# EAGLE design wrt54_relay_board (EAGLE 6.1)
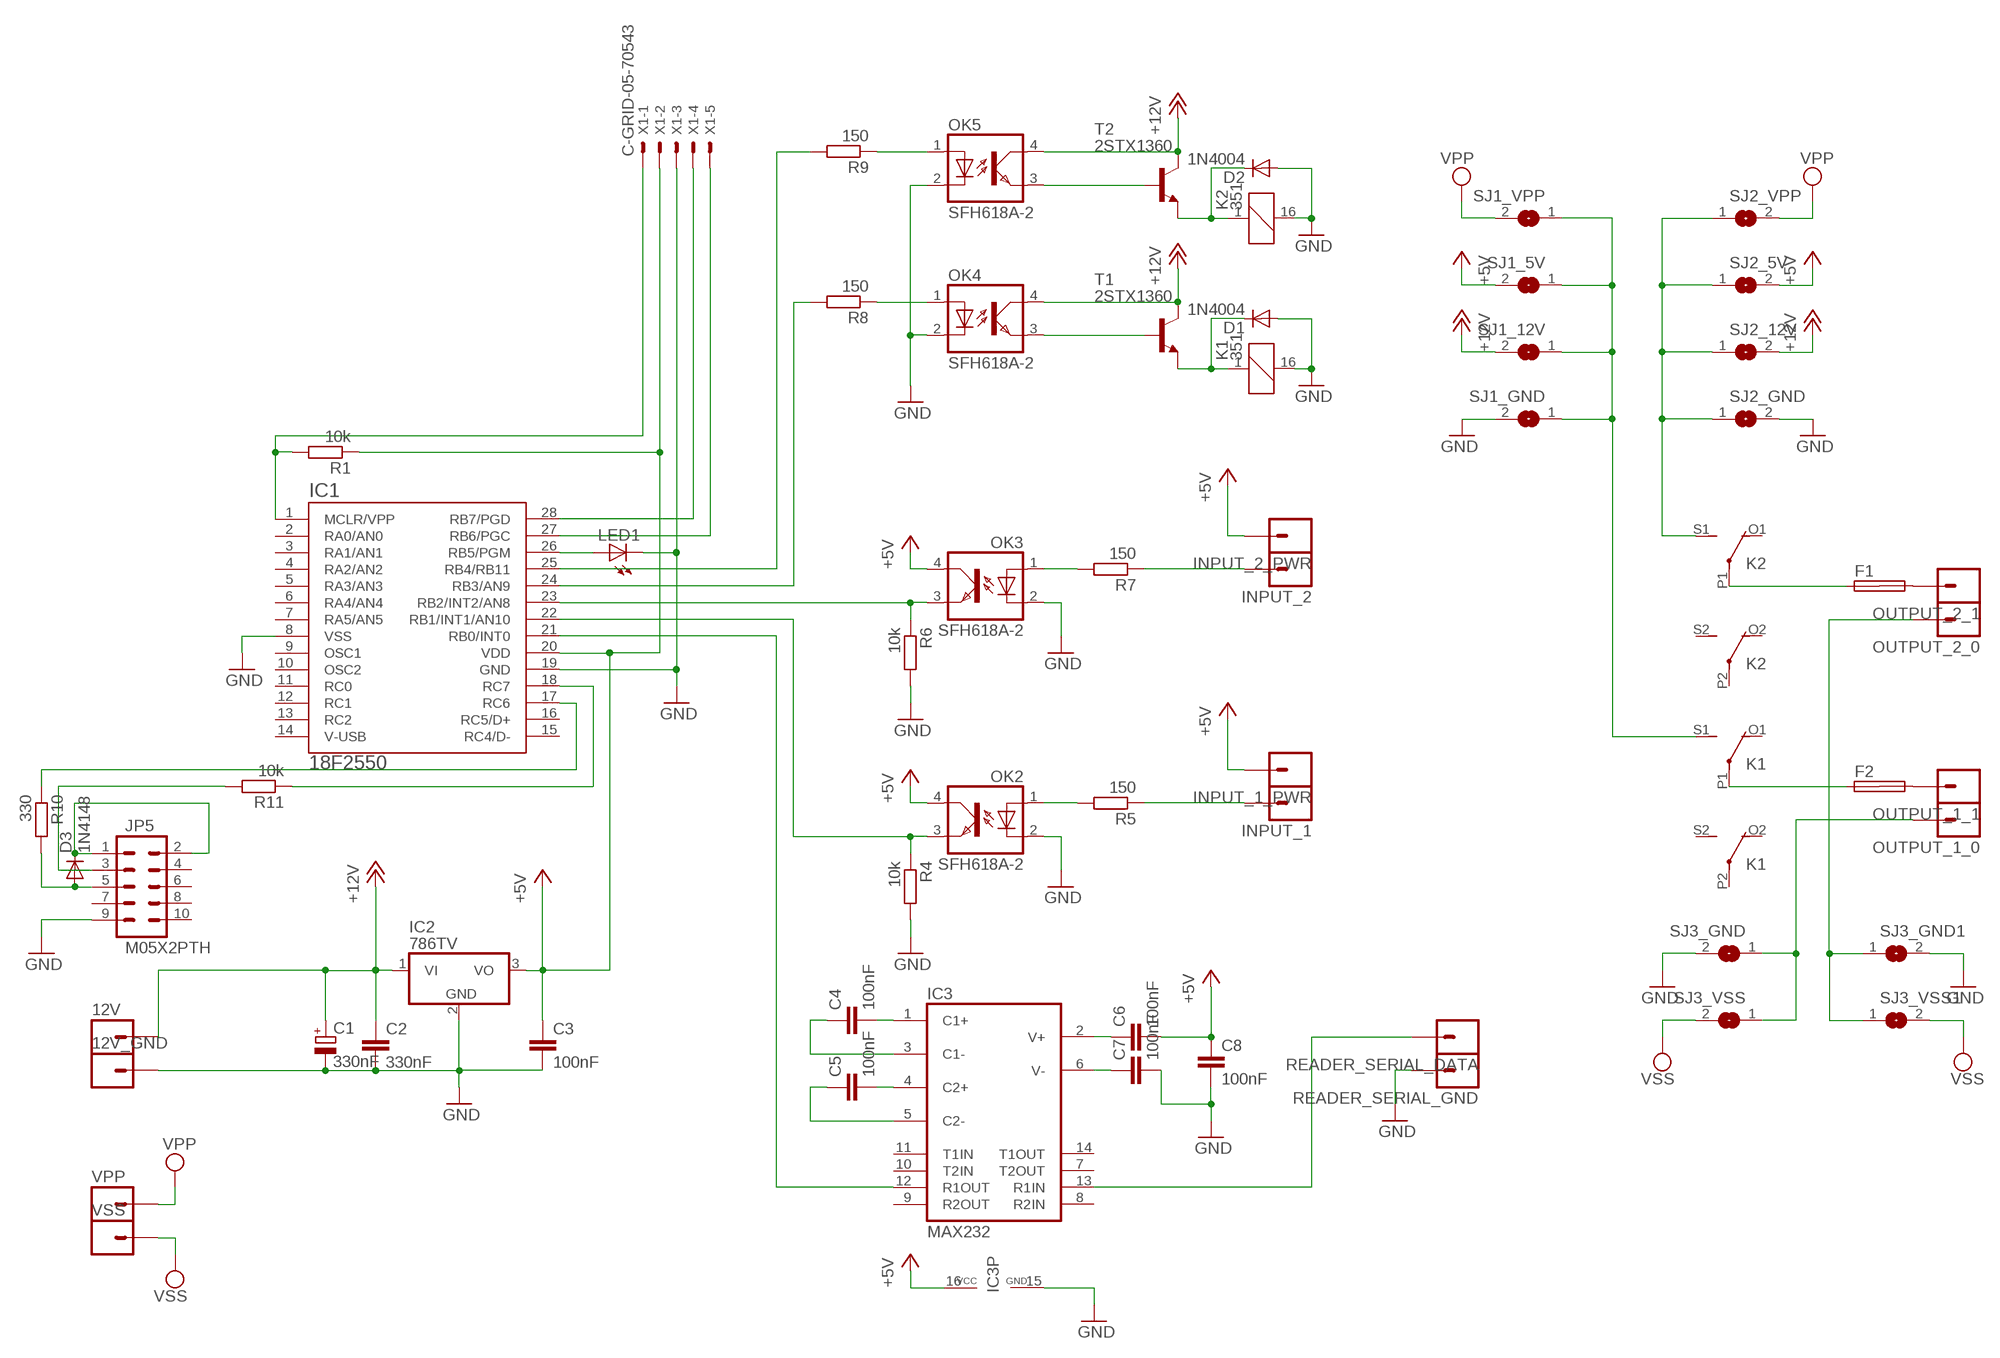
[diagram p0: schematic, sheet 1]

## Parts
12V  M01PTH_LONGPAD  [1X01_LONGPAD]
12V_GND  M01PTH_LONGPAD  [1X01_LONGPAD]
C1  330nF  CPOL-EUE5-6  [E5-6]
C2  330nF  C5/2.5  [C5B2.5]
C3  100nF  C5/2.5  [C5B2.5]
C4  100nF  C5/2.5  [C5B2.5]
C5  100nF  C5/2.5  [C5B2.5]
C6  100nF  C5/2.5  [C5B2.5]
C7  100nF  C5/2.5  [C5B2.5]
C8  100nF  C5/2.5  [C5B2.5]
D1  1N4004  1N4148DO35-7  [DO35-7]
D2  1N4004  1N4148DO35-7  [DO35-7]
D3  1N4148  1N4148DO35-7  [DO35-7]
F1  SHK20L  [SHK20L]
F2  SHK20L  [SHK20L]
IC1  18F2550  PIC18F2550DIL-28  [DIL28]
IC2  786TV  [TO220V]
IC3  MAX232  [DIL16]
INPUT_1  M01PTH_LONGPAD  [1X01_LONGPAD]
INPUT_1_PWR  M01PTH_LONGPAD  [1X01_LONGPAD]
INPUT_2  M01PTH_LONGPAD  [1X01_LONGPAD]
INPUT_2_PWR  M01PTH_LONGPAD  [1X01_LONGPAD]
JP5  M05X2PTH  [AVR_ICSP]
K1  351  [351]
K2  351  [351]
LED1  LED5MM  [LED5MM]
OK2  SFH618A-2  [DIP4]
OK3  SFH618A-2  [DIP4]
OK4  SFH618A-2  [DIP4]
OK5  SFH618A-2  [DIP4]
OUTPUT_1_0  M01PTH_LONGPAD  [1X01_LONGPAD]
OUTPUT_1_1  M01PTH_LONGPAD  [1X01_LONGPAD]
OUTPUT_2_0  M01PTH_LONGPAD  [1X01_LONGPAD]
OUTPUT_2_1  M01PTH_LONGPAD  [1X01_LONGPAD]
R1  10k  R-EU_0204/7  [0204/7]
R4  10k  R-EU_0207/10  [0207/10]
R5  150  R-EU_0204/2V  [0204V]
R6  10k  R-EU_0207/10  [0207/10]
R7  150  R-EU_0204/2V  [0204V]
R8  150  R-EU_0204/7  [0204/7]
R9  150  R-EU_0204/7  [0204/7]
R10  330  R-EU_0204/2V  [0204V]
R11  10k  R-EU_0204/2V  [0204V]
READER_SERIAL_DATA  M01PTH_LONGPAD  [1X01_LONGPAD]
READER_SERIAL_GND  M01PTH_LONGPAD  [1X01_LONGPAD]
SJ1_5V  SJW  [SJW]
SJ1_12V  SJW  [SJW]
SJ1_GND  SJW  [SJW]
SJ1_VPP  SJW  [SJW]
SJ2_5V  SJW  [SJW]
SJ2_12V  SJW  [SJW]
SJ2_GND  SJW  [SJW]
SJ2_VPP  SJW  [SJW]
SJ3_GND  SJW  [SJW]
SJ3_GND1  SJW  [SJW]
SJ3_VSS  SJW  [SJW]
SJ3_VSS1  SJW  [SJW]
T1  2STX1360  2SC1740  [TO92-ECB]
T2  2STX1360  2SC1740  [TO92-ECB]
VPP  M01PTH_LONGPAD  [1X01_LONGPAD]
VSS  M01PTH_LONGPAD  [1X01_LONGPAD]
X1  C-GRID-05-70543  [70543-05]

## Nets
+5V: C3.1 C6.2 C8.1 IC1.20(VDD) IC2.3(VO) IC3.16(VCC) INPUT_1_PWR.1 INPUT_2_PWR.1 OK2.4(COL) OK3.4(COL) R1.1 SJ1_5V.2 SJ2_5V.2 X1.2
+12V: 12V.1 C1.+ C2.1 IC2.1(VI) OK4.4(COL) OK5.4(COL) SJ1_12V.2 SJ2_12V.2 T1.C T2.C
GND [power]: 12V_GND.1 C1.- C2.2 C3.2 C7.2 C8.2 D1.A D2.A IC1.8(VSS) IC1.19(GND) IC2.2(GND) IC3.15(GND) JP5.9 K1.16 K2.16 LED1.K(C) OK2.2(C) OK3.2(C) OK4.2(C) OK5.2(C) R4.2 R6.2 READER_SERIAL_GND.1 SJ1_GND.2 SJ2_GND.2 SJ3_GND1.2 SJ3_GND.2 X1.3
N$1: IC1.23(RB2/INT2/AN8) OK3.3(EMIT) R6.1
N$2: OK2.1(A) R5.2
N$3: INPUT_1.1 R5.1
N$4: IC1.22(RB1/INT1/AN10) OK2.3(EMIT) R4.1
N$5: INPUT_2.1 R7.1
N$6: IC1.25(RB4/RB11) R9.2
N$7: OK5.3(EMIT) T2.B
N$8: OK4.3(EMIT) T1.B
N$9: IC1.28(RB7/PGD) X1.4
N$10: IC1.1(MCLR/VPP) R1.2 X1.1
N$11: D2.C K2.1 T2.E
N$12: D1.C K1.1 T1.E
N$13: C4.2 IC3.1(C1+)
N$14: IC1.26(RB5/PGM) LED1.A
N$15: IC1.21(RB0/INT0) IC3.12(R1OUT)
N$16: IC3.13(R1IN) READER_SERIAL_DATA.1
N$17: OK3.1(A) R7.2
N$18: K2.S1(2:S) SJ2_5V.1 SJ2_12V.1 SJ2_GND.1 SJ2_VPP.1
N$19: OK5.1(A) R9.1
N$20: K1.S1(2:S) SJ1_5V.1 SJ1_12V.1 SJ1_GND.1 SJ1_VPP.1
N$21: F1.2A OUTPUT_2_1.1
N$22: F2.2A OUTPUT_1_1.1
N$23: OUTPUT_1_0.1 SJ3_GND.1 SJ3_VSS.1
N$24: IC1.17(RC6) R10.1
N$25: IC1.18(RC7) R11.1
N$26: OUTPUT_2_0.1 SJ3_GND1.1 SJ3_VSS1.1
N$29: F1.1A K2.P1(2:P)
N$30: F2.1A K1.P1(2:P)
N$31: C5.2 IC3.4(C2+)
N$32: C4.1 IC3.3(C1-)
N$33: D3.C JP5.1 JP5.2
N$34: D3.A JP5.5 R10.2
N$35: C5.1 IC3.5(C2-)
N$36: C6.1 IC3.2(V+)
N$37: C7.1 IC3.6(V-)
N$39: JP5.3 R11.2
N$44: IC1.24(RB3/AN9) R8.2
N$51: OK4.1(A) R8.1
N$53: IC1.27(RB6/PGC) X1.5
VPP: SJ1_VPP.2 SJ2_VPP.2 VPP.1
VSS: SJ3_VSS1.2 SJ3_VSS.2 VSS.1
Unconnected: F1.1B F1.2B F2.1B F2.2B IC1.2(RA0/AN0) IC1.3(RA1/AN1) IC1.4(RA2/AN2) IC1.5(RA3/AN3) IC1.6(RA4/AN4) IC1.7(RA5/AN5) IC1.9(OSC1) IC1.10(OSC2) IC1.11(RC0) IC1.12(RC1) IC1.13(RC2) IC1.14(V-USB) IC1.15(RC4/D-) IC1.16(RC5/D+) IC3.7(T2OUT) IC3.8(R2IN) IC3.9(R2OUT) IC3.10(T2IN) IC3.11(T1IN) IC3.14(T1OUT) JP5.4 JP5.6 JP5.7 JP5.8 JP5.10 K1.O1(2:O) K1.O2(3:O) K1.P2(3:P) K1.S2(3:S) K2.O1(2:O) K2.O2(3:O) K2.P2(3:P) K2.S2(3:S)

## Library data of the parts
12V 12V_GND INPUT_1 INPUT_1_PWR INPUT_2 INPUT_2_PWR OUTPUT_1_0 OUTPUT_1_1 OUTPUT_2_0 OUTPUT_2_1 READER_SERIAL_DATA READER_SERIAL_GND VPP VSS = SparkFun:M01: Header 1 Standard 1-pin 0.1" header. Use with straight break away headers (SKU : PRT-00116), right angle break away headers (PRT-00553), swiss pins (PRT-00743), machine pins (PRT-00117), and female headers (PRT-00115).
C1 = resistor:CPOL-EU: POLARIZED CAPACITOR, European symbol
C2-C8 = capacitor-wima:C: CAPACITOR naming: grid - package width
D1-D3 = diode:1N4148: DIODE high speed (Philips)
F1 F2 = fuse:SHK20L: FUSE HOLDER 5 x 20 mm, SH contact, SHH1 Schukat, E1073 Buerklin; OC_FARNELL: unknown; OC_NEWARK: unknown
IC1 = pic18f2550:PIC18F2550: PIC18F2550 Richard Myrick T. Arellaga April 2010
IC2 = linear:78*: Positive VOLTAGE REGULATOR Source: http://cache.national.com/ds/LM/LM78L05.pdf http://www.fairchildsemi.com/ds/LM/LM7805.pdf
IC3 = maxim:MAX232: RS232 TRANSEIVER; MF: MAXIM; MPN: MAX232ACPE+; OC_FARNELL: 9723773; OC_NEWARK: 68K4544
JP5 = SparkFun:M05X2: Header 5x2 Standard 10-pin dual row 0.1" header. Commonly used with AVR-ISP. Use with Spark Fun Electronics SKU: PRT-00778
K1 K2 = relay:351: RELAY 2 x switch, Omron; OC_FARNELL: unknown; OC_NEWARK: unknown
LED1 = led:LED: LED OSRAM: - CHIPLED LG R971, LG N971, LY N971, LG Q971, LY Q971, LO R971, LY R971 LH N974, LH R974 LS Q976, LO Q976, LY Q976 LO Q996 - Hyper CHIPLED LW Q18S LB Q993, LB Q99A, LB R99A - SideLED LS A670, LO A670, LY A670, LG A670, LP A670 LB A673, LV A673, LT A673, LW A673 LH A674 LY A675 LS A676, LA A676, LO A676, LY A676, LW A676 LS A679, LY A679, LG A679 - Hyper Micro SIDELED® LS Y876, LA Y876, LO Y876, LY Y876 LT Y87S - SmartLED LW L88C, LW L88S LB L89C, LB L89S, LG L890 LS L89K, LO L89K, LY L89K LS L896, LA L896, LO L896, LY L896 - TOPLED LS T670, LO T670, LY T670, LG T670, LP T670 LSG T670, LSP T670, LSY T670, LOP T670, LYG T670 LG T671, LOG T671, LSG T671 LB T673, LV T673, LT T673, LW T673 LH T674 LS T676, LA T676, LO T676, LY T676, LB T676, LH T676, LSB T676, LW T676 LB T67C, LV T67C, LT T67C, LS T67K, LO T67K, LY T67K, LW E67C LS E67B, LA E67B, LO E67B, LY E67B, LB E67C, LV E67C, LT E67C LW T67C LS T679, LY T679, LG T679 LS T770, LO T770, LY T770, LG T770, LP T770 LB T773, LV T773, LT T773, LW T773 LH T774 LS E675, LA E675, LY E675, LS T675 LS T776, LA T776, LO T776, LY T776, LB T776 LHGB T686 LT T68C, LB T68C - Hyper Mini TOPLED® LB M676 - Mini TOPLED Santana® LG M470 LS M47K, LO M47K, LY M47K Source: http://www.osram.convergy.de LUXEON: - LUMILED® LXK2-PW12-R00, LXK2-PW12-S00, LXK2-PW14-U00, LXK2-PW14-V00 LXK2-PM12-R00, LXK2-PM12-S00, LXK2-PM14-U00 LXK2-PE12-Q00, LXK2-PE12-R00, LXK2-PE12-S00, LXK2-PE14-T00, LXK2-PE14-U00 LXK2-PB12-K00, LXK2-PB12-L00, LXK2-PB12-M00, LXK2-PB14-N00, LXK2-PB14-P00, LXK2-PB14-Q00 LXK2-PR12-L00, LXK2-PR12-M00, LXK2-PR14-Q00, LXK2-PR14-R00 LXK2-PD12-Q00, LXK2-PD12-R00, LXK2-PD12-S00 LXK2-PH12-R00, LXK2-PH12-S00 LXK2-PL12-P00, LXK2-PL12-Q00, LXK2-PL12-R00 Source: www.luxeon.com KINGBRIGHT: KA-3528ASYC Source: www.kingbright.com
OK2-OK5 = optocoupler:SFH618?*: Optocoupler, Phototransistor Output, Low Input Current Source: http://www.vishay.com/docs/83673/sfh618.pdf
R1 R4-R11 = resistor:R-EU_: RESISTOR, European symbol
SJ1_5V SJ1_12V SJ1_GND SJ1_VPP SJ2_5V SJ2_12V SJ2_GND SJ2_VPP SJ3_GND SJ3_GND1 SJ3_VSS SJ3_VSS1 = jumper:SJ: SMD solder JUMPER
T1 T2 = transistor:2SC1740: NPN Silicon Epitaxial Planar Transistor Source: SEMTECH ELECTRONICS LTD. 2SC1740.pdf
X1 = con-molex:C-GRID-05: CONNECTOR wire to board 2.54 mm (0.100") pitch header

## Net classes
1 power: width 1.676 mm, clearance 0.508 mm

## Board
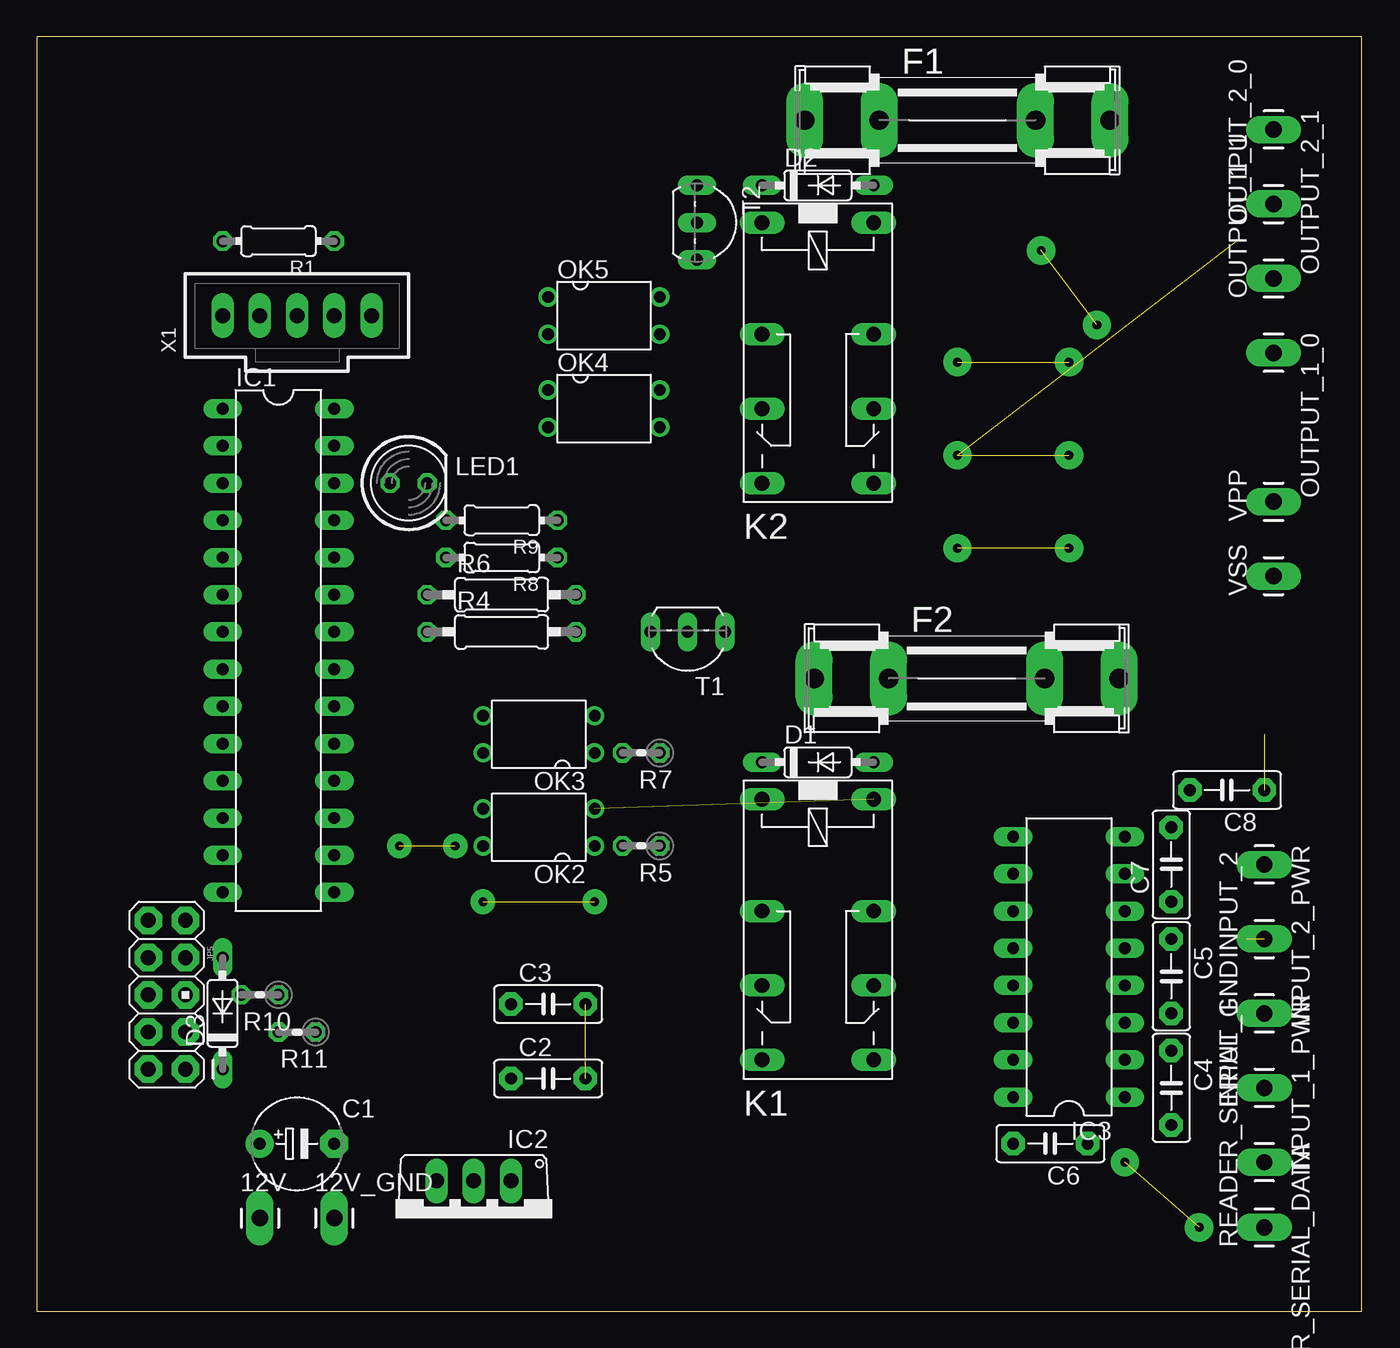
[diagram p1: board, top side]
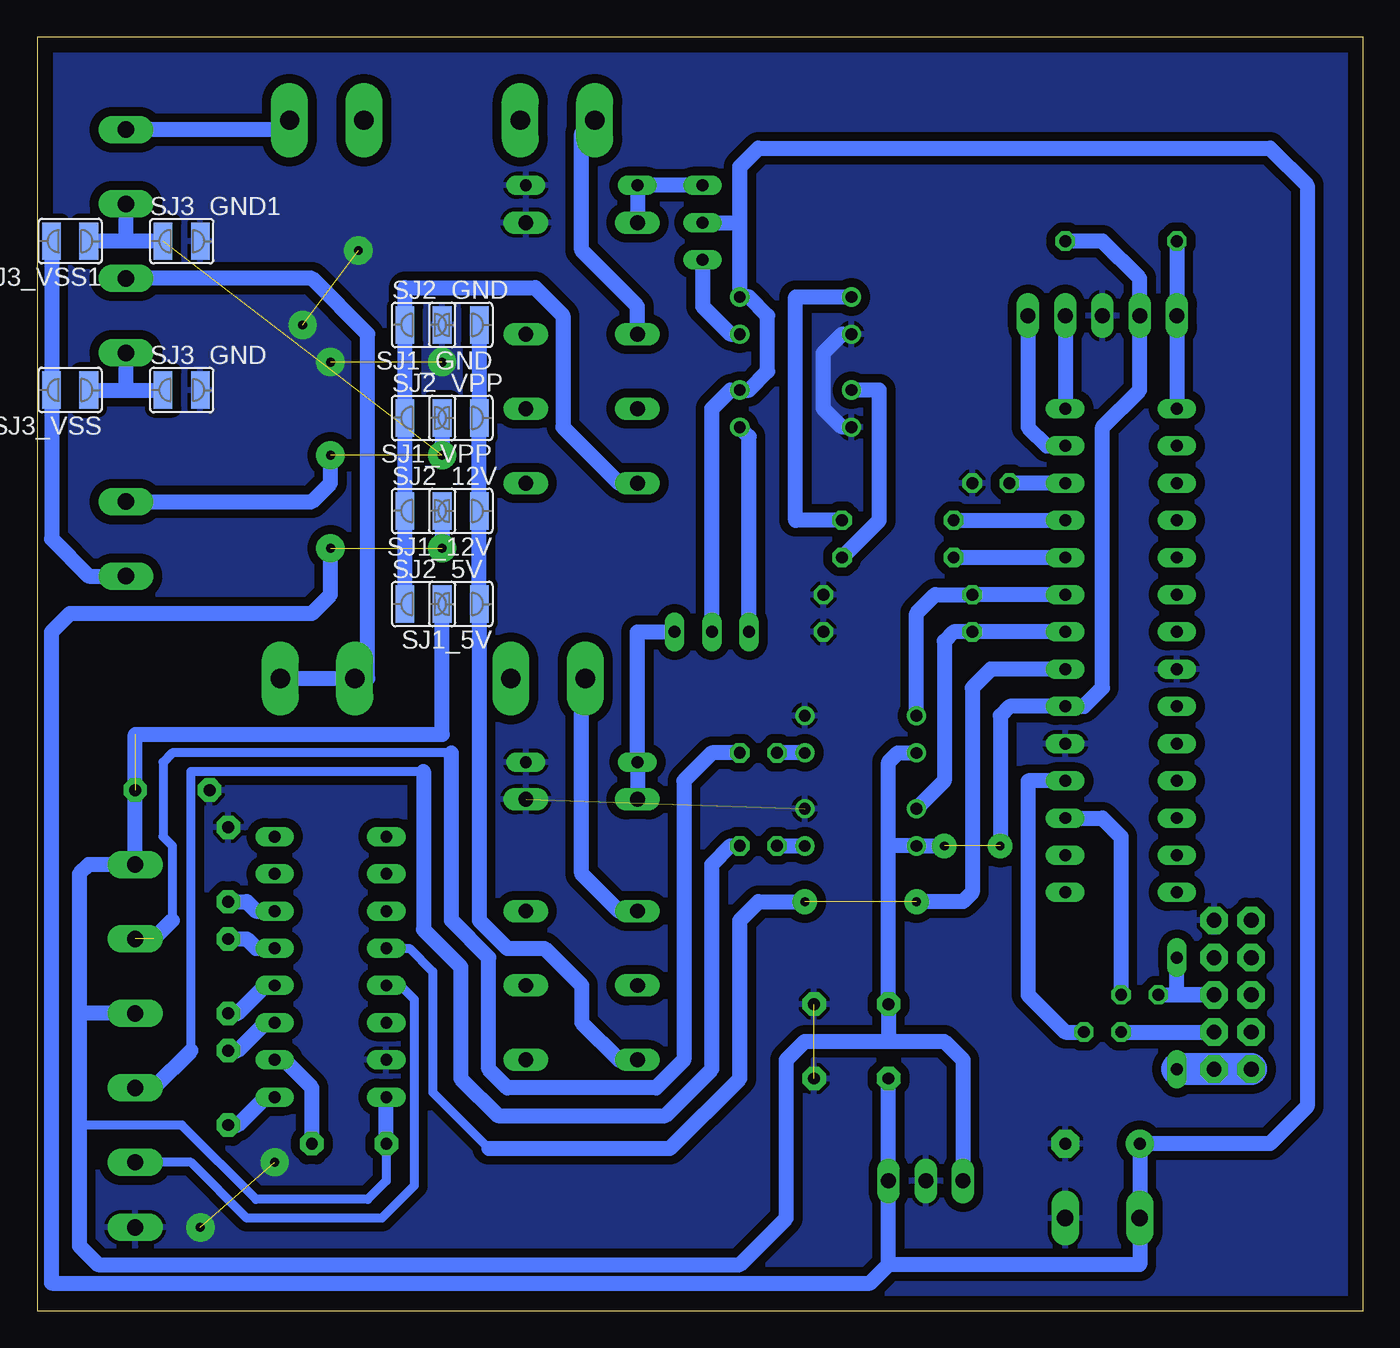
[diagram p2: board, bottom side, seen from below]

Size 90.48 x 86.99 mm. Coordinates in mm from the lower left corner, seen from the top.
Outline: 0,0 90.48,0 90.48,86.99 0,86.99 0,0
Copper layers (1*16): Top 0.035mm / dielectric 1.5mm / Bottom 0.035mm
Design rules: minimum track width 10mil, minimum drill 24mil, track to track 8mil, track to pad 8mil, pad to pad 8mil, via to via 8mil, smd to smd 8mil, copper to edge 40mil, drill to drill 8mil, minimum pad ring 10mil, minimum via ring 8mil, stop-mask expansion 4mil, vias tented up to drill 0mil, thermal gap 10mil

### Footprints (pad centres in the part's own frame; a part is rotated, then mirrored left to right if it is on the bottom)
1X01_LONGPAD = drill 1.118 pad 1.88 long: 1 0,0
E5-6 = drill 0.813 pad 1.905: + -2.54,0 | drill 0.813 pad 1.905 octagon: - 2.54,0
C5B2.5 = drill 0.813 pad 1.6 octagon: 1 -2.54,0; 2 2.54,0
DO35-7 = drill 0.813 long: A 3.81,0; C -3.81,0
SHK20L = drill 1.321 pad 2.54 long: 1A -10.414,0; 1B -5.334,0; 2A 10.414,0; 2B 5.334,0
DIL28 = drill 0.813 long: 1 -16.51,-3.81; 2 -13.97,-3.81; 3 -11.43,-3.81; 4 -8.89,-3.81; 5 -6.35,-3.81; 6 -3.81,-3.81; 7 -1.27,-3.81; 8 1.27,-3.81; 9 3.81,-3.81; 10 6.35,-3.81; 11 8.89,-3.81; 12 11.43,-3.81; 13 13.97,-3.81; 14 16.51,-3.81; 15 16.51,3.81; 16 13.97,3.81; 17 11.43,3.81; 18 8.89,3.81; 19 6.35,3.81; 20 3.81,3.81; 21 1.27,3.81; 22 -1.27,3.81; 23 -3.81,3.81; 24 -6.35,3.81; 25 -8.89,3.81; 26 -11.43,3.81; 27 -13.97,3.81; 28 -16.51,3.81
TO220V = drill 1.016 long: 1 -2.54,-2.54; 2 0,-2.54; 3 2.54,-2.54
DIL16 = drill 0.813 long: 1 -8.89,-3.81; 2 -6.35,-3.81; 3 -3.81,-3.81; 4 -1.27,-3.81; 5 1.27,-3.81; 6 3.81,-3.81; 7 6.35,-3.81; 8 8.89,-3.81; 9 8.89,3.81; 10 6.35,3.81; 11 3.81,3.81; 12 1.27,3.81; 13 -1.27,3.81; 14 -3.81,3.81; 15 -6.35,3.81; 16 -8.89,3.81
AVR_ICSP = drill 1.016 pad 1.88 octagon: 1 -1.27,5.08; 2 1.27,5.08; 3 -1.27,2.54; 4 1.27,2.54; 5 -1.27,0; 6 1.27,0; 7 -1.27,-2.54; 8 1.27,-2.54; 9 -1.27,-5.08; 10 1.27,-5.08
351 = drill 1.016 long: 1 -3.81,-3.81; 16 -3.81,3.81; O1 8.89,-3.81; O2 8.89,3.81; P1 3.81,-3.81; P2 3.81,3.81; S1 13.97,-3.81; S2 13.97,3.81
LED5MM = drill 0.813 octagon: A -1.27,0; K 1.27,0
DIP4 = drill 0.8: 1 -1.27,-3.81; 2 1.27,-3.81; 3 1.27,3.81; 4 -1.27,3.81
0204/7 = drill 0.813 octagon: 1 -3.81,0; 2 3.81,0
0207/10 = drill 0.813 octagon: 1 -5.08,0; 2 5.08,0
0204V = drill 0.813 octagon: 1 -1.27,0; 2 1.27,0
SJW = smd 1.27 x 2.54: 1 -1.27,0; 2 1.27,0
TO92-ECB = drill 0.813 long: B 2.54,0; C 0,0; E -2.54,0
70543-05 = drill 1.016 long: 1 -5.08,0; 2 -2.54,0; 3 0,0; 4 2.54,0; 5 5.08,0

### Placement (x,y rotation side)
12V  15.24,6.35 0 top
12V_GND  20.32,6.35 0 top
C1  17.78,11.43 0 top
C2  34.92,15.88 0 top
C3  34.92,20.96 0 top
C4  77.47,15.24 270 top
C5  77.47,22.86 270 top
C6  69.22,11.43 180 top
C7  77.47,30.48 90 top
C8  81.28,35.56 180 top
D1  53.34,37.47 0 top
D2  53.34,76.84 0 top
D3  12.7,20.32 90 top
F1  62.87,81.28 0 top
F2  63.5,43.18 0 top
IC1  16.51,45.09 270 top
IC2  29.84,6.35 180 top
IC3  70.48,23.5 90 top
INPUT_1  83.82,15.24 90 top
INPUT_1_PWR  83.82,20.32 270 top
INPUT_2  83.82,25.4 90 top
INPUT_2_PWR  83.82,30.48 270 top
JP5  8.89,21.59 180 top
K1  53.34,31.12 270 top
K2  53.34,70.49 270 top
LED1  25.4,56.52 0 top
OK2  34.29,33.02 90 top
OK3  34.29,39.37 90 top
OK4  38.73,61.59 270 top
OK5  38.73,67.94 270 top
OUTPUT_1_0  84.46,65.41 270 top
OUTPUT_1_1  84.46,70.49 90 top
OUTPUT_2_0  84.46,75.56 90 top
OUTPUT_2_1  84.46,80.65 270 top
R1  16.51,73.03 180 top
R4  31.75,46.35 0 top
R5  41.27,31.75 180 top
R6  31.75,48.9 0 top
R7  41.27,38.1 180 top
R8  31.75,51.44 180 top
R9  31.75,53.98 180 top
R10  15.24,21.59 180 top
R11  17.78,19.05 180 top
READER_SERIAL_DATA  83.82,10.16 270 top
READER_SERIAL_GND  83.82,5.71 90 top
SJ1_5V  61.59,48.26 180 bottom
SJ1_12V  61.59,54.61 180 bottom
SJ1_GND  61.59,67.31 180 bottom
SJ1_VPP  61.59,60.96 180 bottom
SJ2_5V  64.14,48.26 0 bottom
SJ2_12V  64.14,54.61 0 bottom
SJ2_GND  64.14,67.31 0 bottom
SJ2_VPP  64.14,60.96 0 bottom
SJ3_GND  80.65,62.87 0 bottom
SJ3_GND1  80.65,73.03 0 bottom
SJ3_VSS  88.27,62.87 180 bottom
SJ3_VSS1  88.27,73.03 180 bottom
T1  44.45,46.35 180 top
T2  45.09,74.29 270 top
VPP  84.46,55.24 90 top
VSS  84.46,50.16 90 top
X1  17.78,67.94 0 top

### Tracks (layer width: path | path; a pad name or v marks a point on that pad's centre or on a via)
+5V  (via drill 0.6 pad 1.68)  (2 unrouted)
  Bottom 0.61: IC3.16 66.68,8.89 67.95,7.62 75.57,7.62 80.65,12.7 87.31,12.7 87.63,13.02
  Bottom 1.016: R1.1 17.78,73.03 15.24,70.49 X1.2 15.24,62.87 17.78,60.33 17.78,42.55 19.05,41.27 IC1.20 24.13,41.27 24.77,40.64 v24.77,31.75 | SJ1_5V.2 62.87,39.37 83.82,39.37 INPUT_2_PWR.1 87,30.48 87.63,29.84 87.63,20.32 | 32.38,31.75 C3.1 32.38,18.41 | 32.38,31.75 32.38,37.47 31.75,38.1 OK3.4 | 32.38,31.75 OK2.4 28.57,31.75 | 87.63,20.32 87.63,13.02 87.63,4.45 86.36,3.18 42.55,3.18 39.37,6.35 39.37,17.14 38.1,18.41 32.38,18.41 | INPUT_1_PWR.1 87.63,20.32 | 32.38,18.41 28.57,18.41 27.3,17.14 IC2.3 | C6.2 IC3.16
+12V  (via drill 0.6 pad 1.93)  (1 unrouted)
  Bottom 1.016: SJ1_12V.2 62.87,52.07 | 42.55,74.29 OK5.4 41.91,69.22 40.64,67.94 40.64,64.13 41.91,62.87 OK4.4 43.18,62.87 44.45,61.59 T1.C | 42.55,74.29 42.55,78.1 41.27,79.38 6.35,79.38 3.81,76.84 3.81,13.97 6.35,11.43 C1.+ 12V.1 15.24,3.18 32.38,3.18 | T2.C 42.55,74.29 | v70.48,52.07 70.48,48.9 71.76,47.62 88.27,47.62 89.54,46.35 89.54,1.91 33.66,1.91 32.38,3.18 | 32.38,3.18 IC2.1 C2.1
GND  (via drill 0.6 pad 1.93)  (5 unrouted)
  Bottom 1.016: OK4.2 35.56,60.33 36.83,61.59 36.83,65.41 35.56,66.67 OK5.2
  other vias: 70.48,64.77 62.87,64.77 68.58,72.39 72.39,67.31 79.38,5.71 74.3,10.16
  pour Bottom (isolate 0.61): 0.64,85.72 89.54,85.72 89.54,0 0.64,0
N$1
  Bottom 1.016: IC1.23 R6.1 29.21,48.9 30.48,47.62 OK3.3
N$2
  Bottom 1.016: R5.2 OK2.1
N$3
  Bottom 0.61: 80.01,17.78 80.01,36.83 64.14,36.83
  Bottom 1.016: INPUT_1.1 82.55,15.24 80.01,17.78 | 64.14,36.83 64.14,26.04 61.59,23.5 61.59,15.88 59.05,13.34 47.62,13.34 44.45,16.51 44.45,30.48 43.18,31.75 R5.1
N$4
  Bottom 1.016: IC1.22 R4.1 27.94,46.35 28.57,45.72 28.57,36.2 OK2.3
N$5  (1 unrouted)
  Bottom 0.61: 62.23,38.1 81.28,38.1 81.92,37.47 81.92,32.39 81.28,31.75 81.28,26.67
  Bottom 1.016: R7.1 44.45,38.1 46.35,36.2 46.35,17.14 48.26,15.24 58.42,15.24 59.69,16.51 59.69,24.13 62.23,26.67 62.23,38.1 | 81.28,26.67 82.55,25.4
N$6
  Bottom 1.016: R9.2 IC1.25
N$7
  Bottom 1.016: T2.B 45.09,68.58 43.18,66.67 OK5.3
N$8
  Bottom 1.016: T1.B 41.91,59.69 OK4.3
N$9
  Bottom 1.016: X1.4 IC1.28
N$10
  Bottom 1.016: R1.2 X1.1 IC1.1
N$11
  Bottom 1.016: T2.E D2.C K2.1
N$12
  Bottom 1.016: K1.1 D1.C 49.53,46.35 T1.E
N$13
  Bottom 1.016: C4.2 76.84,12.7 74.93,14.61 IC3.1
N$14
  Bottom 1.016: IC1.26 LED1.A
N$15  (via drill 0.6 pad 1.68)  (1 unrouted)
  Bottom 0.61: IC3.12 65.09,24.77 63.5,23.18 63.5,14.92 59.69,11.11
  Bottom 1.016: 59.69,11.11 47.31,11.11 42.55,15.88 42.55,26.67 41.27,27.94 v38.1,27.94 | IC1.21 25.4,43.81 26.67,42.55 26.67,28.57 27.3,27.94 v30.48,27.94
N$16
  Bottom 0.61: IC3.13 65.72,22.23 64.77,21.27 64.77,8.57 66.99,6.35 76.2,6.35 80.01,10.16 READER_SERIAL_DATA.1
N$17
  Bottom 1.016: OK3.1 R7.2
N$18
  Bottom 1.016: SJ2_5V.1 SJ2_12V.1 SJ2_VPP.1 SJ2_GND.1 65.41,69.85 56.52,69.85 54.61,67.94 54.61,60.33 50.8,56.52 K2.S1
N$19
  Bottom 1.016: R9.1 38.73,53.98 38.73,69.22 OK5.1
N$20
  Bottom 1.016: SJ1_GND.1 SJ1_VPP.1 SJ1_12V.1 SJ1_5V.1 60.32,26.67 58.42,24.77 55.88,24.77 53.34,22.23 53.34,19.69 50.8,17.14 K1.S1
N$21
  Bottom 1.016: F1.2A 73.28,81.03 73.66,80.65 OUTPUT_2_1.1
N$22
  Bottom 1.016: F2.2A 67.95,43.18 67.95,66.67 71.76,70.49 OUTPUT_1_1.1
N$23
  Bottom 1.016: SJ3_VSS.1 84.46,62.87 | 84.46,62.87 SJ3_GND.1 | OUTPUT_1_0.1 84.46,62.87
N$24
  Bottom 1.016: IC1.17 17.78,33.66 16.51,32.39 R10.1
N$25
  Bottom 1.016: IC1.18 22.86,36.2 22.86,21.59 20.32,19.05 R11.1
N$26  (via drill 0.6 pad 1.93)  (1 unrouted)
  Bottom 1.016: SJ3_GND1.1 84.46,73.03 | 84.46,73.03 SJ3_VSS1.1 | OUTPUT_2_0.1 84.46,73.03
  other vias: 62.87,58.42
N$27  (via drill 0.6 pad 1.93)
  other vias: 70.48,58.42
N$28  (via drill 0.6 pad 1.93)
  other vias: 62.87,52.07
N$29
  Bottom 1.016: K2.P1 49.53,68.58 53.34,72.39 53.34,80.39 F1.1A
N$30
  Bottom 1.016: K1.P1 50.8,27.3 53.34,29.84 53.34,42.93 F2.1A
N$31
  Bottom 1.016: C5.2 76.84,20.32 74.93,22.23 IC3.4
N$32
  Bottom 1.016: C4.1 76.84,17.78 74.93,19.69 IC3.3
N$33
  Bottom 2.184: JP5.2 JP5.1 D3.C
N$34
  Bottom 1.016: R10.2 JP5.5 12.7,21.59 D3.A
N$35
  Bottom 1.016: C5.1 76.2,25.4 75.57,24.77 IC3.5
N$36
  Bottom 1.016: C6.1 71.76,15.24 73.66,17.14 IC3.2
N$37
  Bottom 1.016: C7.1 76.2,27.94 75.57,27.3 IC3.6
N$38  (via drill 0.6 pad 1.68)
  other vias: 28.57,31.75
N$39
  Bottom 1.016: R11.2 JP5.3
N$44
  Bottom 1.016: IC1.24 R8.2
N$51
  Bottom 1.016: R8.1 33.02,53.98 33.02,62.87 OK4.1
N$53
  Bottom 1.016: X1.5 22.86,60.33 21.59,59.05 IC1.27
VPP  (1 unrouted)
  Bottom 1.016: VPP.1 71.76,55.24 70.48,56.52 70.48,58.42 | SJ1_VPP.2 62.87,58.42
VSS
  Bottom 1.016: VSS.1 87,50.16 89.54,52.7 SJ3_VSS.2 SJ3_VSS1.2